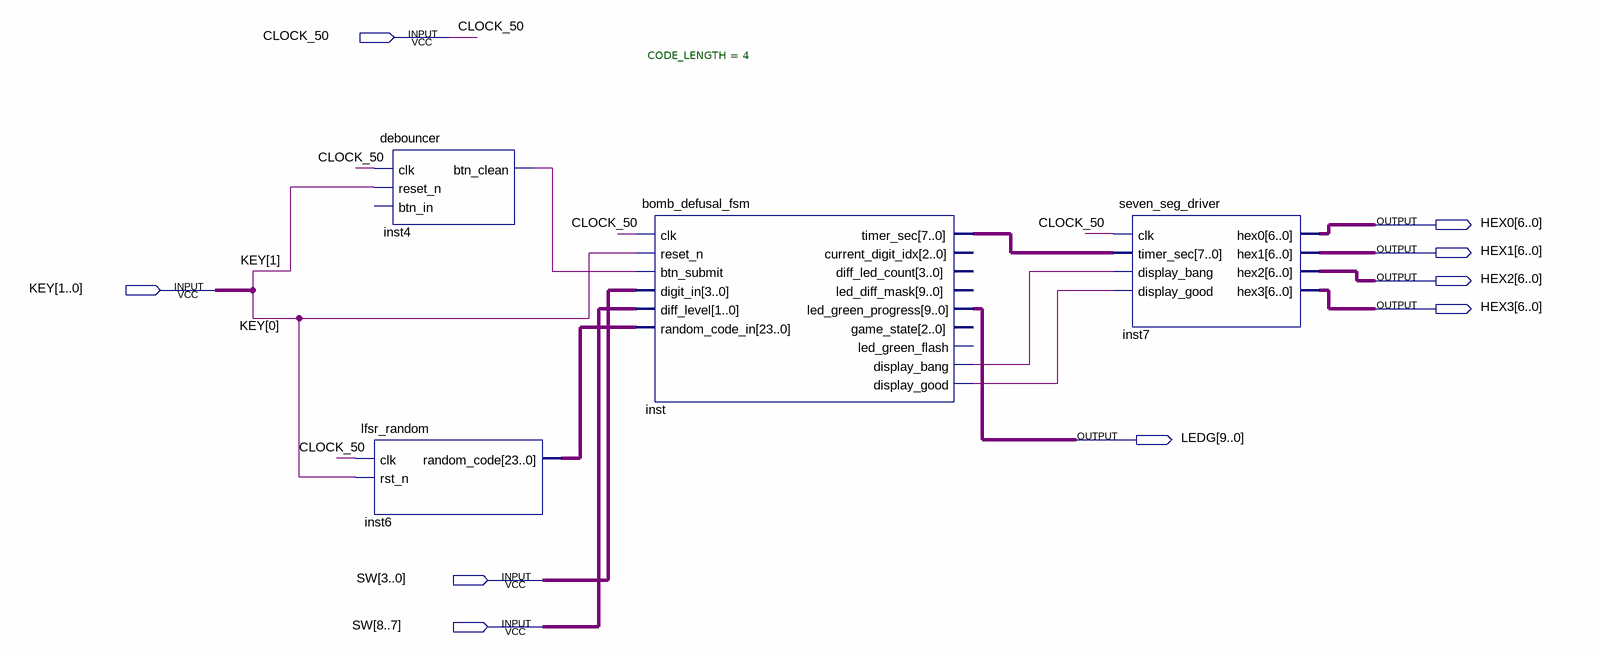
[diagram p0: schematic sheet]
// Quartus schematic bomb_top.bdf as structural Verilog: 4 symbols, 9 pins
module bomb_top (
  input  CLOCK_50,
  input  [1:0] KEY,
  input  [8:0] SW,
  output [6:0] HEX0,
  output [6:0] HEX1,
  output [6:0] HEX2,
  output [6:0] HEX3,
  output [9:0] LEDG
);

  wire inst4_btn_clean, inst_display_bang, inst_display_good;
  wire [7:0] inst_timer_sec;
  wire [23:0] inst6_random_code;

  debouncer inst4 (.clk(CLOCK_50), .reset_n(KEY[1]), .btn_clean(inst4_btn_clean));  // open: btn_in
  lfsr_random inst6 (.clk(CLOCK_50), .rst_n(KEY[0]), .random_code(inst6_random_code));
  bomb_defusal_fsm #(.CODE_LENGTH(4)) inst (
    .clk(CLOCK_50), .reset_n(KEY[0]), .btn_submit(inst4_btn_clean), .digit_in(SW[3:0]), .diff_level(SW[8:7]),
    .random_code_in(inst6_random_code), .timer_sec(inst_timer_sec), .led_green_progress(LEDG),
    .display_bang(inst_display_bang), .display_good(inst_display_good));  // open: current_digit_idx, diff_led_count, led_diff_mask, game_state, led_green_flash
  seven_seg_driver inst7 (
    .clk(CLOCK_50), .timer_sec(inst_timer_sec), .display_bang(inst_display_bang),
    .display_good(inst_display_good), .hex0(HEX0), .hex1(HEX1), .hex2(HEX2), .hex3(HEX3));
endmodule
